# EasyEDA Pro project ProPrj_1-Schematic_NFC PCB Card_2026-05-14.epro

# Schematic NFC PCB Card
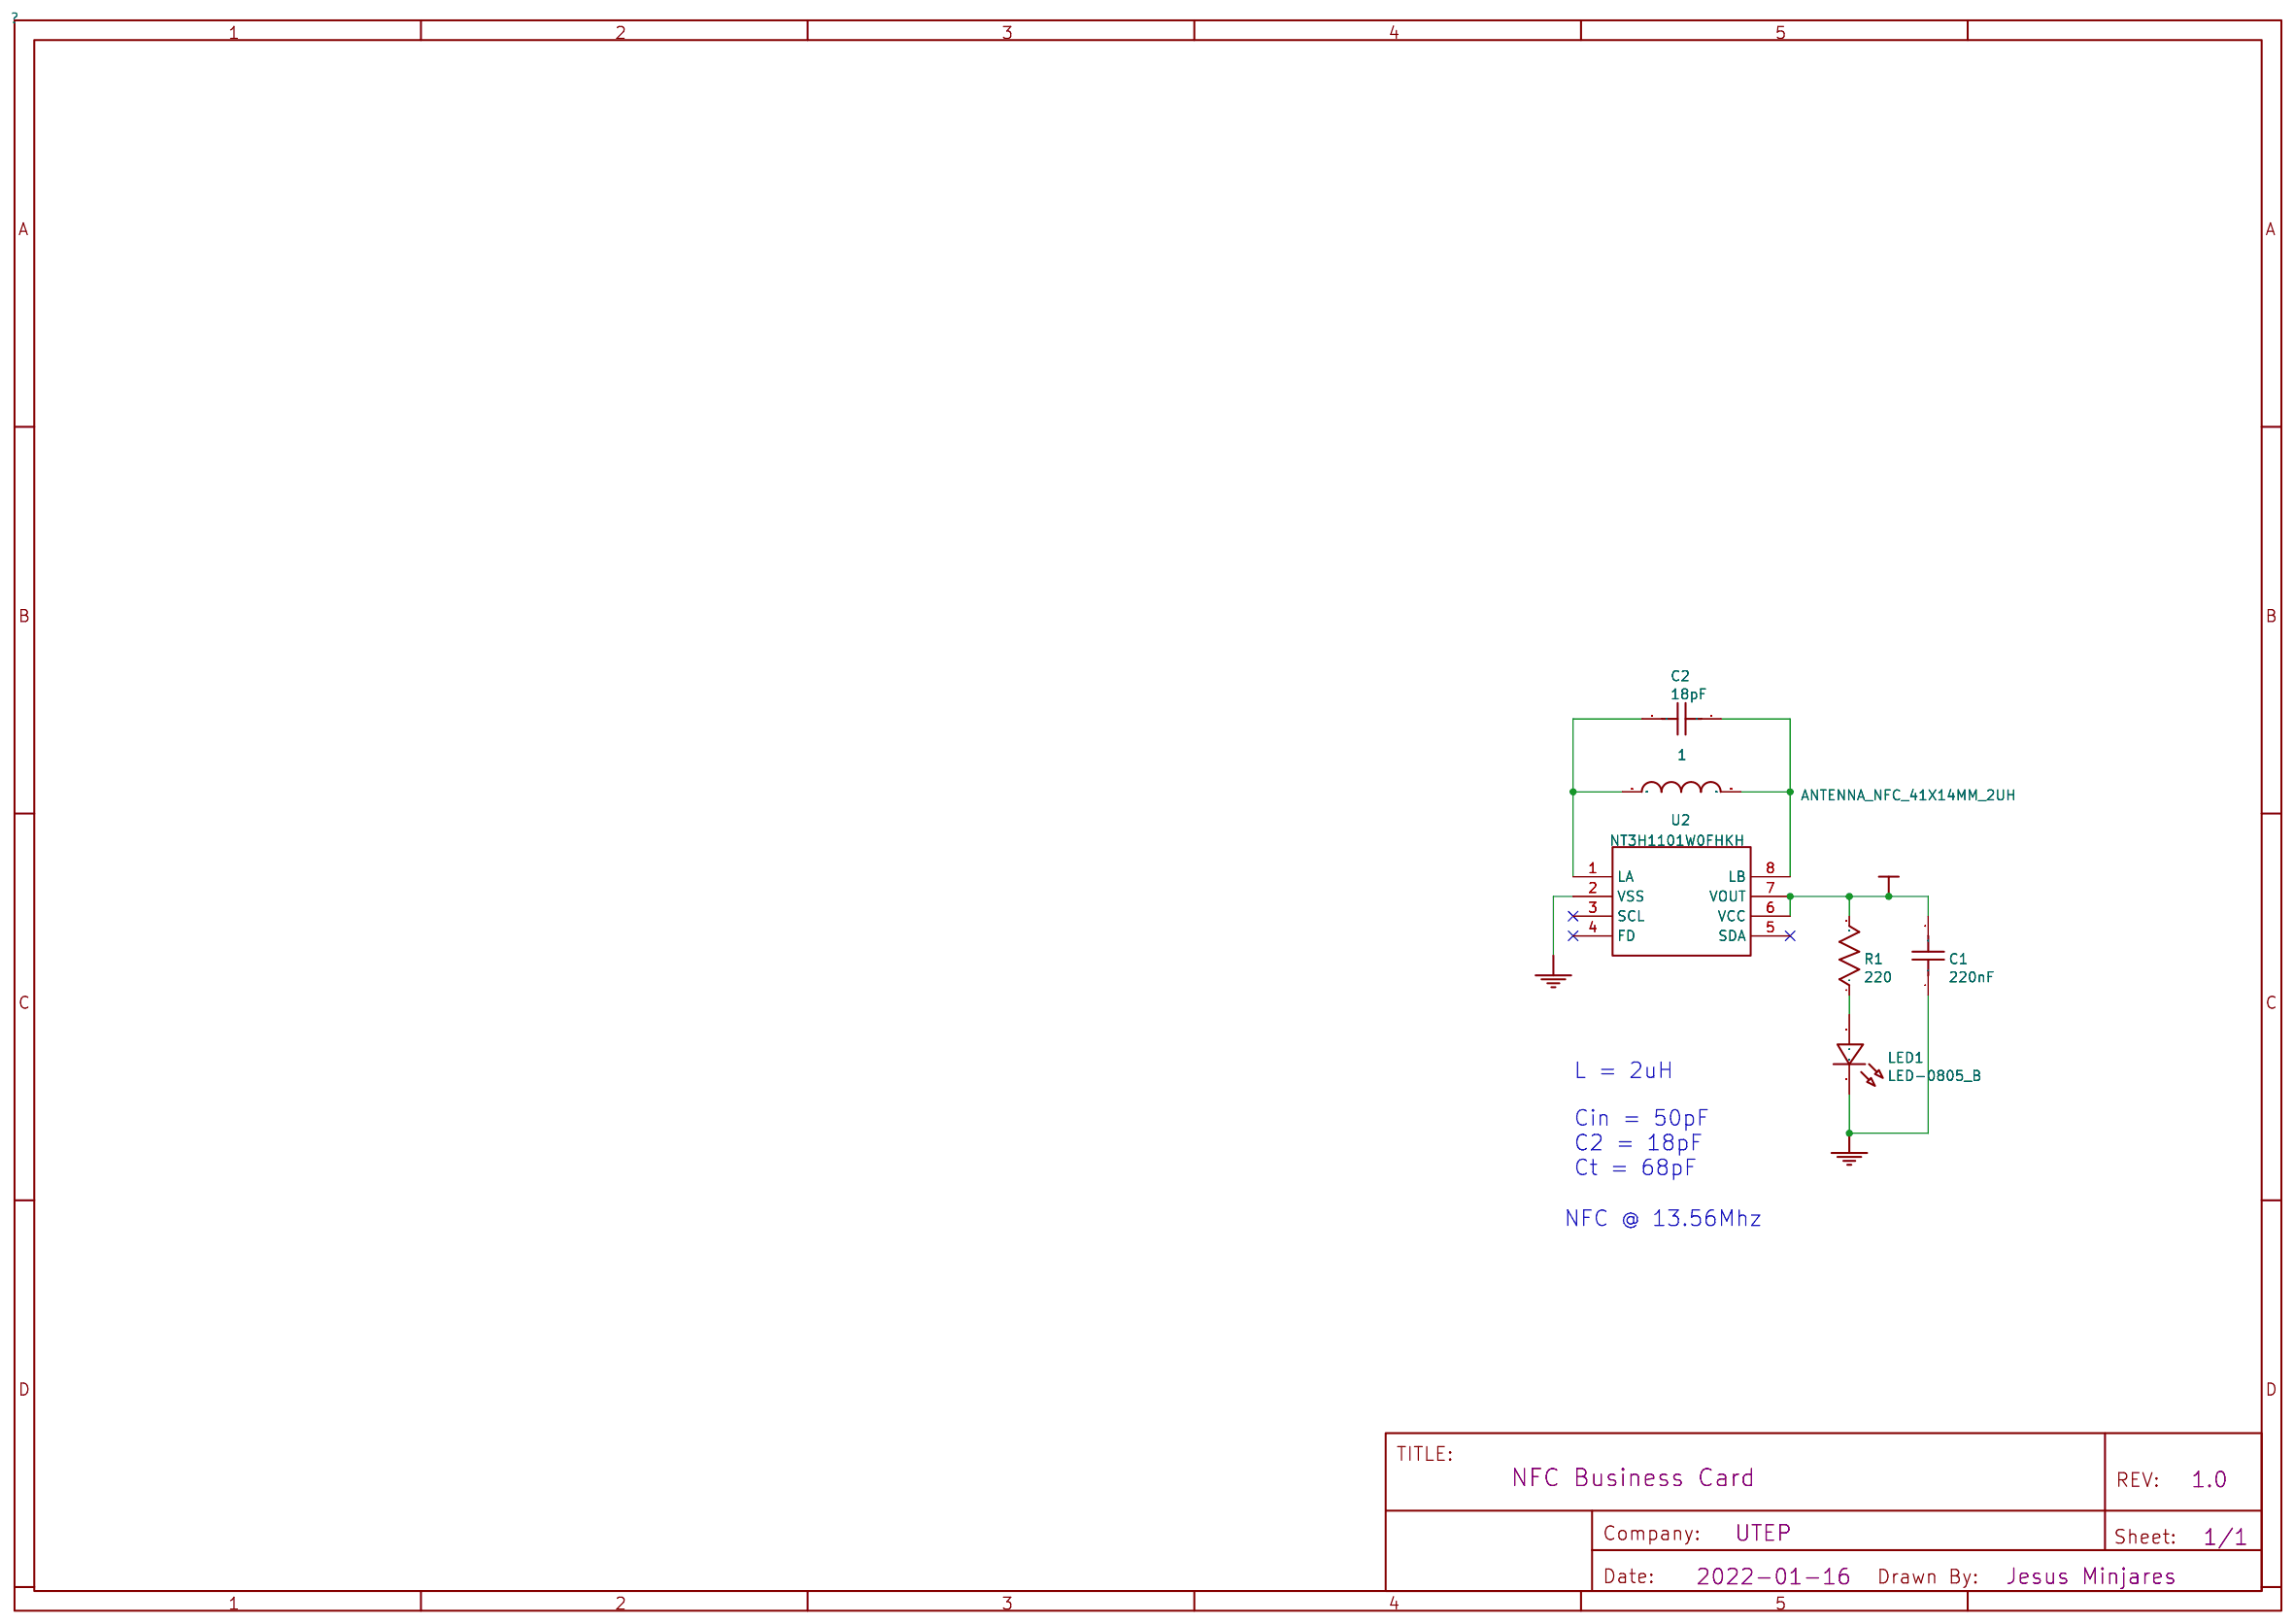
[diagram p0: schematic sheet]

## Parts
1  ANTENNA_NFC_41X14MM_2UH
C1  220nF
C2  18pF
LED1  LED-0805_B
R1  220
U2  NT3H1101W0FHKH

## Library data of the parts
1 = ANTENNA_NFC_41X14MM_2UH: Contributor: Dan Schnur; spicePre: ?
C1 = 220nF: nameAlias: Value(F); Contributor: LCEDA_Lib; spicePre: C; spiceSymbolName: C_0603_US
C2 = 18pF: nameAlias: Value(F); Contributor: LCEDA_Lib; spicePre: C; spiceSymbolName: C_0603_US
LED1 = D-B080508B1-KS2: Manufacturer: 方舟 ARKLED; Supplier Part: C108412; Contributor: LCEDA_Lib; spicePre: L
R1 = 220: nameAlias: Value(Ω); Contributor: LCEDA_Lib; spicePre: R; spiceSymbolName: R_0603_US
U2 = NT3H1101W0FHKH: Supplier: LCSC; Supplier Part: C73156; Manufacturer: NXP Semicon; JLCPCB Part Class: Extend; JLCPCB SMD: Yes; Contributor: LCSC; spicePre: U

## Nets
GND: C1.1 LED1.2 U2.2(VSS)
VCC: C1.2 R1.2 U2.6(VCC) U2.7(VOUT)
Net-(1-P$1): 1.P$1 C2.1 U2.1(LA)
Net-(1-P$2): 1.P$2 C2.2 U2.8(LB)
Net-(LED1-1): LED1.1 R1.1

Not connected (* = marked no-connect by the designer): U2 3(SCL)* 4(FD)* 5(SDA)*

## Notes on the sheet
- L = 2uH
- Cin = 50pF
  C2 = 18pF
  Ct = 68pF
- NFC @ 13.56Mhz

# Board 1-PCB_PCB_NFC PCB Card
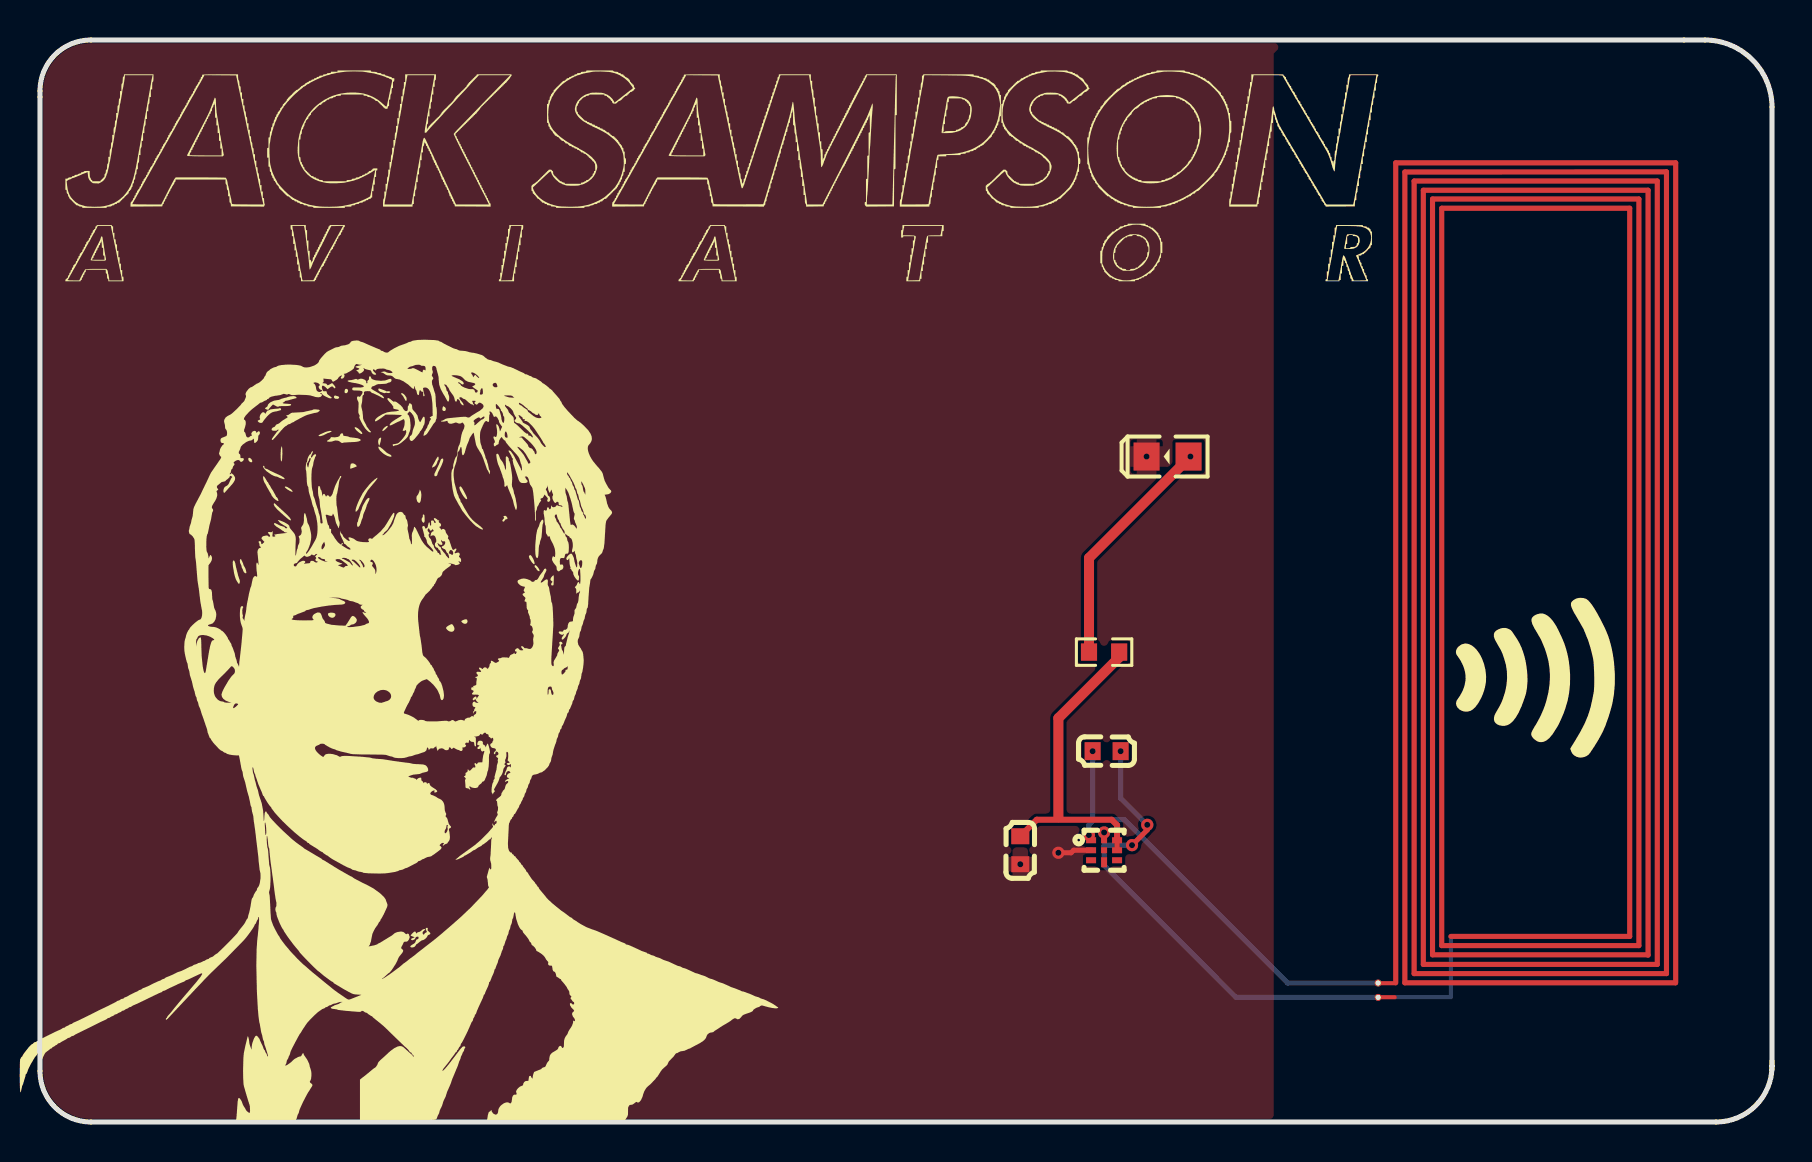
[diagram p1: board, top side]
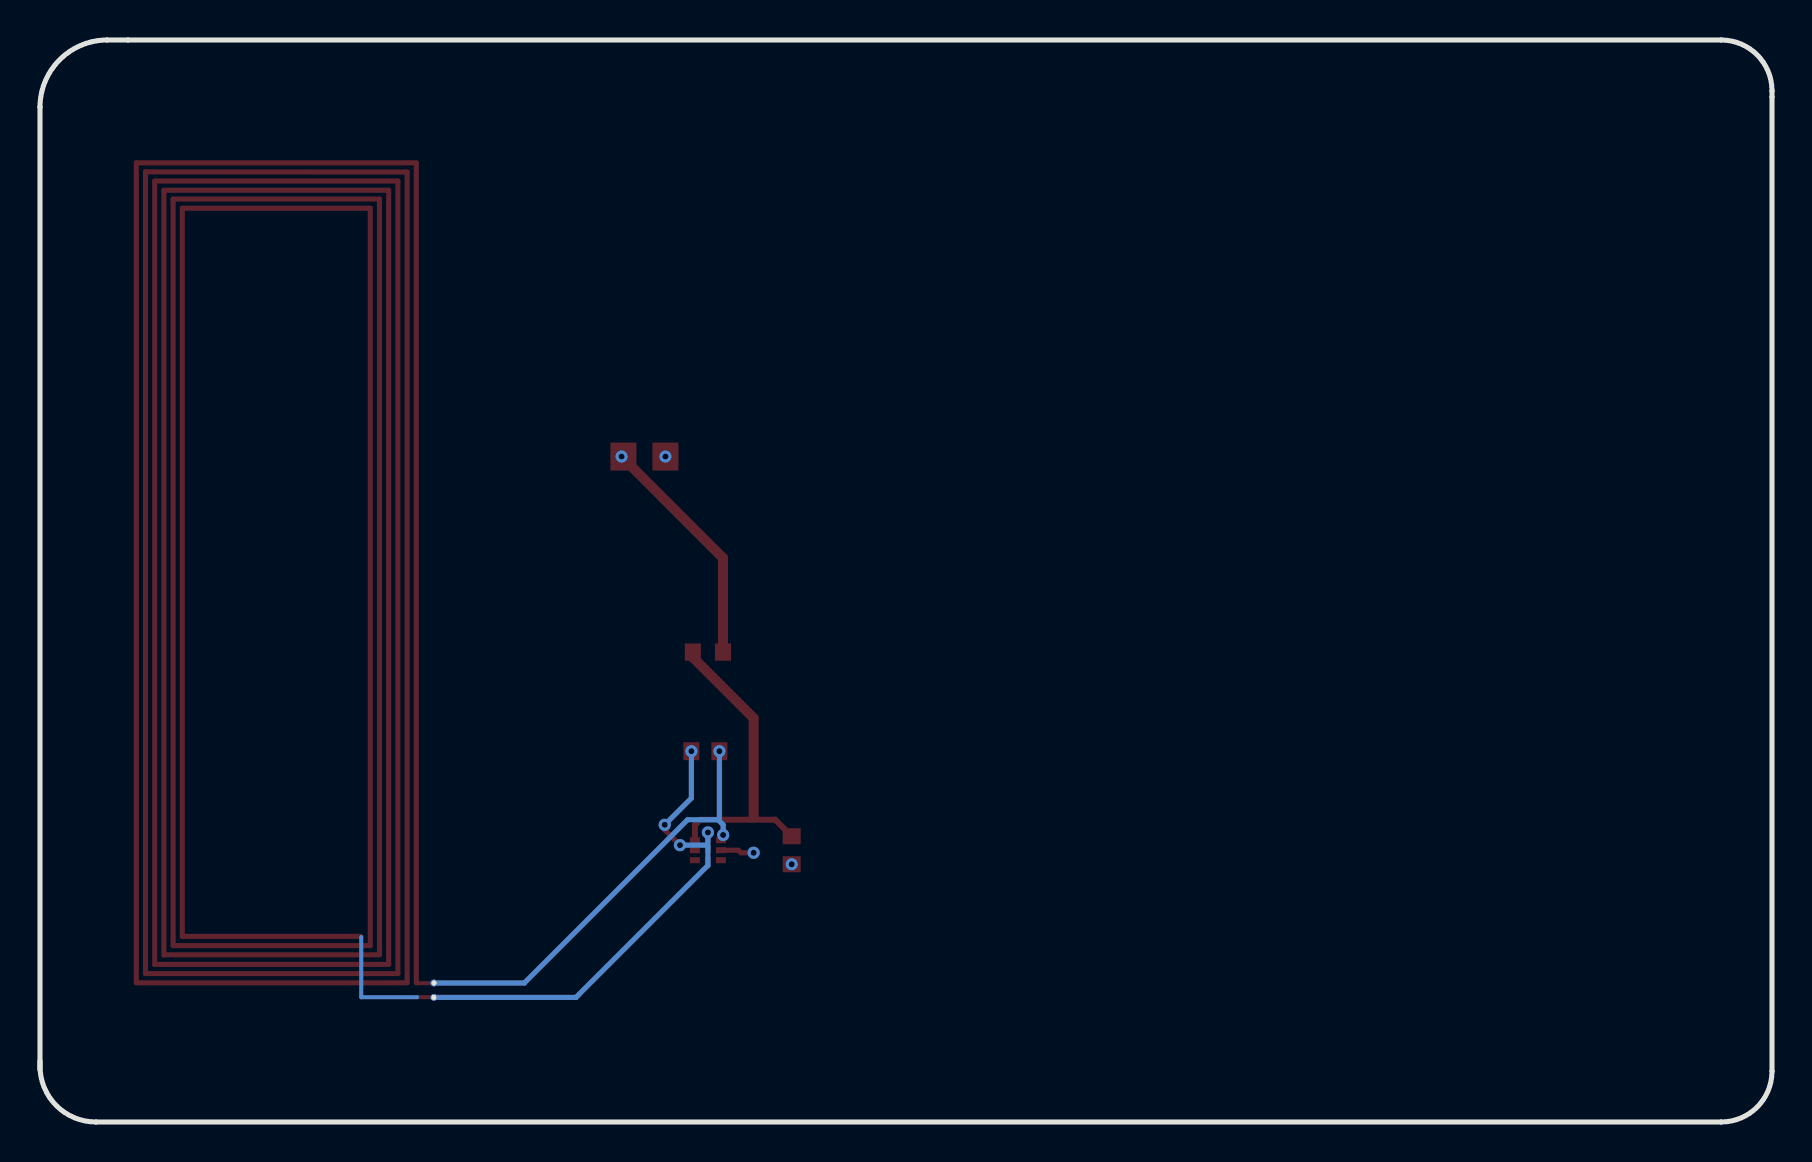
[diagram p2: board, bottom side, seen from below]

Outline 86.61 x 54.1 mm; copper layers: Top Layer, Bottom Layer. Coordinates in mm from the lower left corner of the outline.
Outline path: 86.61,3.05 86.61,2.79 arc(85.8,0.82) 83.82,0 2.54,0 arc(0.74,0.74) 0,2.54 0,51.56 arc(0.74,53.36) 2.54,54.1 83.25,54.1 arc(85.63,53.12) 86.61,50.74 86.61,2.6
Stack: Top Layer 0.035mm / Dielectric1 1.51mm FR4 er 4.5 / Bottom Layer 0.035mm

## Design rules (mm)
spacing Default (default): track to track 0.152, other pairs 0 to 0.152
track width Default (default): min 0.254, default 0.254, max 25.4
differential pair differentialPair (default): width min 0.127, default 0.254, max 2.54; gap min 0.152, default 0.152
via Default (default): diameter min 0.61, default 0.61, max 100.025; hole min 0.305, default 0.305, max 59.995

## Placement (name value [footprint] x y rotation side)
1  ANTENNA_NFC_41X14MM_2UH  [25X48MM_NFC_ANTENNA]  75.06 26.67 270 top
C1  220nF  [C0603]  49.02 13.59 0 top
C2  18pF  [C0603#2]  53.34 18.54 0 top
LED1  LED-0805_B  [LED0805_BLUE]  56.39 33.27 180 top
R1  220  [R0603]  53.21 23.5 0 top
U2  NT3H1101W0FHKH  [XQFN-8_L1.6-W1.6-P0.50-BR]  53.21 13.59 0 top

## Footprints (pads in the part's own frame, mm; a bottom-side part is the same pattern mirrored in y, then rotated)
25X48MM_NFC_ANTENNA
  round 0.35 hole 0.254: P$1(19.72,-8.14) P$2(20.44,-8.14)
C0603
  rect 0.9x0.8 smd: 1(0,-0.7) 2(0,0.7)
C0603#2
  rect 0.8x0.9 smd: 1(-0.7,0) 2(0.7,0)
LED0805_BLUE
  rect 1.3x1.399 smd: 1(-1.05,0) 2(1.05,0)
R0603
  rect 0.806x0.864 smd: 1(-0.753,0) 2(0.753,0)
XQFN-8_L1.6-W1.6-P0.50-BR
  rect 0.5x0.3 smd: 1(-0.65,0.5) 2(-0.65,0) 3(-0.65,-0.5) 5(0.65,-0.5) 6(0.65,0) 7(0.65,0.5)
  rect 0.3x0.5 smd: 4(0,-0.6) 8(0,0.6)
  rect 0.3x0.3 smd: 9(0,0)

## Nets
GND: C1.1 LED1.2 U2.2
VCC: C1.2 R1.2 U2.6 U2.7
LED1_1: LED1.1 R1.1
U2_1: 1.P$1 C2.1 U2.1
U2_8: 1.P$2 C2.2 U2.8

Pads without a net: U2 3 4 5 9

## Via types
v1: diameter 0.61, hole 0.305, Top Layer to Bottom Layer, 10 vias

## Routing (per net, layer and track width the routed paths; a pad name or vN(x,y) marks a point on that pad's centre or on a via; arc(x,y) is an arc through that point)
GND: length 1.7
  Top Layer w0.254: v1(50.93,13.46) 51.56,13.46 51.69,13.59 U2.2
  vias: v1(49.02,12.89) v1(55.34,33.27)
VCC: length 16.1
  Top Layer w0.254: U2.7 U2.6
  Top Layer w0.3: 49.02,14.29 49.84,15.11 53.59,15.11 53.86,14.84 U2.7
  Top Layer w0.5: 53.97,23.5 53.97,23.23 50.93,20.19 50.93,15.24
LED1_1: length 11.9
  Top Layer w0.5: v1(57.53,33.27) 52.46,28.2 R1.1
U2_1: length 21.9
  Bottom Layer w0.254: v1(52.64,18.54) 52.64,15.11 ; v1(52.45,14.35) 52.45,14.86 52.71,15.11 54.23,15.11 62.39,6.95 1.P$1
U2_8: length 25.1
  Top Layer w0.254: v1(54.61,13.84) 55.37,14.61 v1(55.37,14.86)
  Bottom Layer w0.254: 1.P$2 59.81,6.23 53.21,12.83 v1(53.21,14.48) ; 53.21,13.8 53.26,13.84 v1(54.61,13.84) ; v1(54.04,18.54) 54.04,16.19 v1(55.37,14.86)

## Copper pours and planes (outline as drawn; the poured copper is in the pictures)
GND on Top Layer: 0.13,54.36 0.64,53.85 61.98,53.85 61.59,53.47 61.59,-0.51 61.21,-0.13 0.25,-0.13
